# Altium schematic sheet Power Supply.SchDoc
size A4
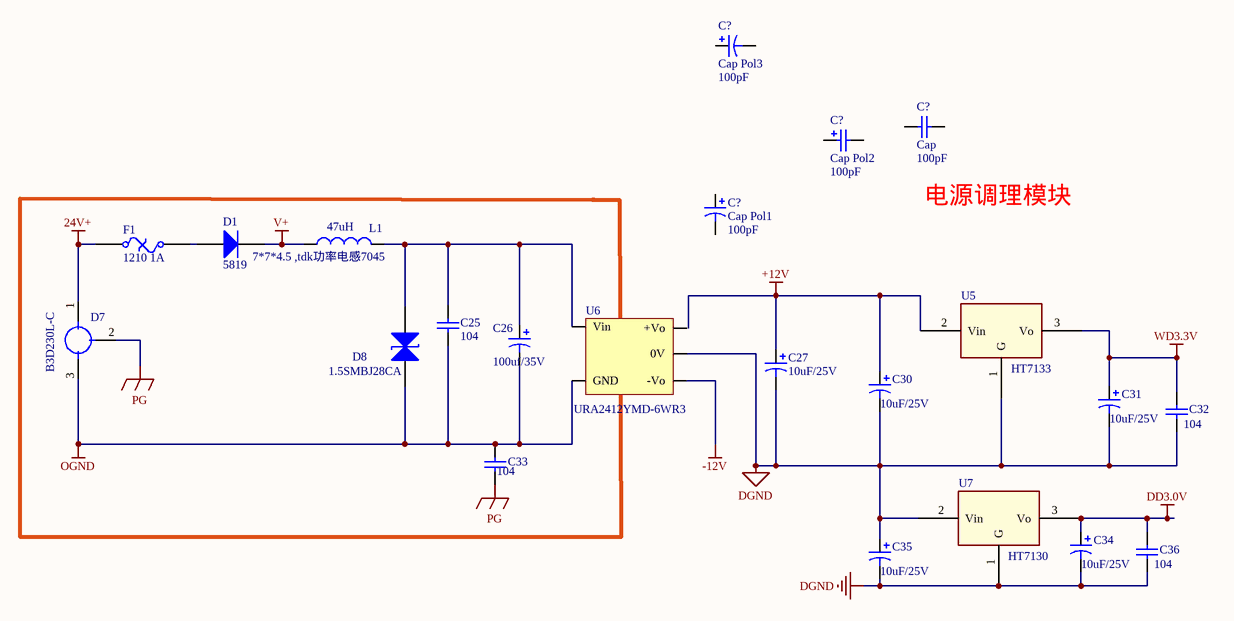
[diagram p0: Power Supply.SchDoc]

## Parts
(Parts that share a designator on the sheet are numbered #1, #2 ... from top to bottom, then left to right.)
C25  104  [0805]
C26  value 100uf/35V  [C5X5]  (hidden comment: 10uf/35V)
C27  10uF/25V  [3216]
C30  value 10uF/25V  [3216]  (hidden comment: 10uF)
C31  value 10uF/25V  [3216]  (hidden comment: 10uF)
C32  104  [0805]
C33  104  [1812]
C34  value 10uF/25V  [3216]  (hidden comment: 10uF)
C35  value 10uF/25V  [3216]  (hidden comment: 10uF)
C36  104  [0805]
C?#1  Cap Pol3  value 100pF  [C0805]
C?#2  Cap  value 100pF  [RAD-0.3]
C?#3  Cap Pol2  value 100pF  [POLAR0.8]
C?#4  Cap Pol1  value 100pF  [RB7.6-15]
D1  5819  [SMC]
D7  B3D230L-C  [B3D090L-C]
D8  1.5SMBJ28CA  [7227-D]
F1  1210 1A  [PIN-W2/E2.8]
L1  value 47uH  [L7X7]  (hidden comment: 100uH)
U5  HT7133  [SOT-89-2]
U6  URA2412YMD-6WR3
U7  HT7130  [SOT-89-2]

## Blocks framed on the sheet
7*7*4.5 ,tdk功率电感7045: C25 C26 C33 D1 D7 D8 F1 L1

## Nets
24V+: D7.1 F1.1
+12V: C27.1 C30.1 U5.2(Vin)
-12V: U6.4(-Vo)
DD3.0V: C34.1 C36.2 U7.3(Vo)
DGND: C27.2 C30.2 C31.2 C32.1 C34.2 C35.1 C35.2 C36.1 U5.1(G) U6.4(0V) U7.1(G) U7.2(Vin)
OGND: C25.1 C26.2 C33.2 D7.3 D8.1(K) U6.1(GND)
PG: C33.1 D7.2
V+: D1.2(K) L1.1
WD3.3V: C31.1 C32.2 U5.3(Vo)
NetC25_2: C25.2 C26.1 D8.2(A) L1.2 U6.2(Vin)
NetD1_1: D1.1(A) F1.2

Not connected (* = marked no-connect by the designer): C?#1 1 2; C?#2 1 2; C?#3 1 2; C?#4 1 2; U6 3(+Vo)

## Notes on the sheet
- 电源调理模块

## Library data of the parts
C25 C33 = Cap_1: Capacitor; Published: 8-Jun-2000; LatestRevisionDate: 17-Jul-2002; LatestRevisionNote: Re-released for DXP Platform.; PackageReference: RAD-0.3; Publisher: Altium Limited; Value: 104
C26 C?#3 = Cap Pol2: Polarized Capacitor (Axial); Published: 8-Jun-2000; LatestRevisionDate: 17-Jul-2002; LatestRevisionNote: Re-released for DXP Platform.; PackageReference: POLAR0.8; Publisher: Altium Limited
  C?#3: PackageDescription: Polarized Capacitor; 2 Leads
C27 = Cap Pol1: Polarized Capacitor (Radial); Value: 10uF/16V; Published: 8-Jun-2000; LatestRevisionDate: 17-Jul-2002; LatestRevisionNote: Re-released for DXP Platform.; PackageReference: RB7.6-15; Publisher: Altium Limited
C30 C31 C34 C35 C?#4 = Cap Pol1: Polarized Capacitor (Radial); Published: 8-Jun-2000; LatestRevisionDate: 17-Jul-2002; LatestRevisionNote: Re-released for DXP Platform.; PackageReference: RB7.6-15; Publisher: Altium Limited
  C?#4: PackageDescription: Polarized Capacitor (Radial); 2 Leads
C32 C36 C?#2 = Cap: Capacitor; Published: 8-Jun-2000; LatestRevisionDate: 17-Jul-2002; LatestRevisionNote: Re-released for DXP Platform.; PackageReference: RAD-0.3; Publisher: Altium Limited
  C32 C36: Value: 104
  C?#2: PackageDescription: Radial Cap, Thru-Hole; 2 Leads; 0.3 in Pin Spacing
C?#1 = Cap Pol3: Polarized Capacitor (Surface Mount); Published: 8-Jun-2000; LatestRevisionDate: 29-May-2009; LatestRevisionNote: IPC-7351 Footprint Added.; PackageReference: C0805; Publisher: Altium Limited; PackageDescription: Chip Capacitor
D1 = Diode: Default Diode; Published: 8-Jun-2000; LatestRevisionDate: 17-Jul-2002; LatestRevisionNote: Re-released for DXP Platform.; PackageVersion: Sep-1996; PackageReference: SMC; Publisher: Altium Limited; PackageDescription: DO-214-AB/SMC; 2 C-Bend Leads; Body 7.9 x 5.9 mm, inc. leads (LxW); Code_JEDEC: DO-214-AB
D8 = TVS
F1 = Fuse Thermal: Thermal Fuse; Published: 24-Mar-1999; LatestRevisionDate: 17-Jul-2002; LatestRevisionNote: Re-released for DXP Platform.; PackageReference: PIN-W2/E2.8; Publisher: Altium Limited; PackageDescription: Thru-Hole; 2 Leads
L1 = Inductor: Code_IEC: 1005; Published: 8-Jun-2000; LatestRevisionDate: 17-Jul-2002; LatestRevisionNote: Re-released for DXP Platform.; PackageReference: 0402-A; Publisher: Altium Limited; Code_JEITA: 0402
U5 U7 = HT7150-1
U6 = URB2409YMD-6WR3_1 双路